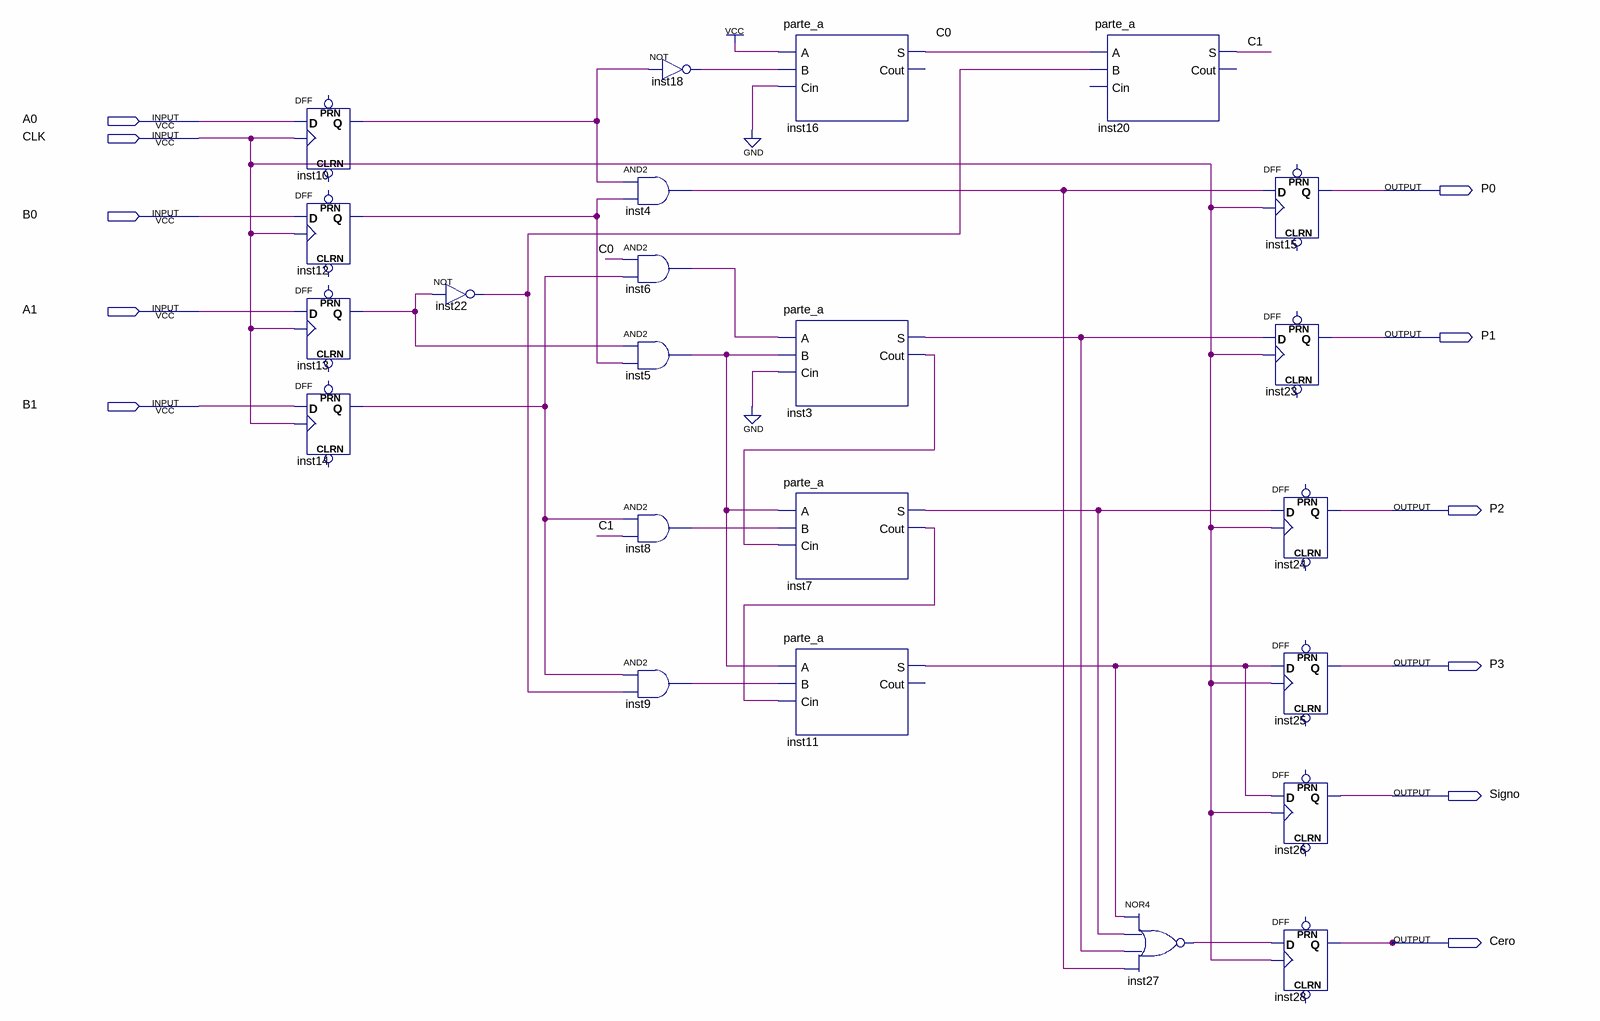
[diagram p0: schematic sheet]
// Quartus schematic parte_c.bdf as structural Verilog: 23 symbols, 11 pins
module parte_c (
  input  A0,
  input  CLK,
  input  B0,
  input  A1,
  input  B1,
  output P0,
  output P1,
  output P2,
  output P3,
  output Signo,
  output Cero
);

  wire C0, C1, inst3_cout, inst3_s, inst4_out, inst5_out, inst6_out, inst7_cout, inst7_s, inst8_out,
       inst9_out, inst10_q, inst11_s, inst12_q, inst13_q, inst14_q, inst18_out, inst22_out, inst27_out;

  DFF inst10 (.CLK(CLK), .D(A0), .Q(inst10_q));  // open: CLRN, PRN
  DFF inst12 (.CLK(CLK), .D(B0), .Q(inst12_q));  // open: CLRN, PRN
  DFF inst13 (.CLK(CLK), .D(A1), .Q(inst13_q));  // open: CLRN, PRN
  DFF inst14 (.CLK(CLK), .D(B1), .Q(inst14_q));  // open: CLRN, PRN
  not inst22 (inst22_out, inst13_q);
  and inst4 (inst4_out, inst10_q, inst12_q);
  and inst6 (inst6_out, C0, inst14_q);
  and inst5 (inst5_out, inst13_q, inst12_q);
  and inst8 (inst8_out, inst14_q, C1);
  and inst9 (inst9_out, inst14_q, inst22_out);
  not inst18 (inst18_out, inst10_q);
  parte_a inst16 (.A(1'b1), .B(inst18_out), .Cin(1'b0), .S(C0));  // open: Cout
  parte_a inst3 (.A(inst6_out), .B(inst5_out), .Cin(1'b0), .S(inst3_s), .Cout(inst3_cout));
  parte_a inst7 (.A(inst5_out), .B(inst8_out), .Cin(inst3_cout), .S(inst7_s), .Cout(inst7_cout));
  parte_a inst11 (.A(inst5_out), .B(inst9_out), .Cin(inst7_cout), .S(inst11_s));  // open: Cout
  parte_a inst20 (.A(C0), .B(inst22_out), .S(C1));  // open: Cin, Cout
  nor inst27 (inst27_out, inst11_s, inst7_s, inst3_s, inst4_out);
  DFF inst15 (.CLK(CLK), .D(inst4_out), .Q(P0));  // open: CLRN, PRN
  DFF inst23 (.CLK(CLK), .D(inst3_s), .Q(P1));  // open: CLRN, PRN
  DFF inst24 (.CLK(CLK), .D(inst7_s), .Q(P2));  // open: CLRN, PRN
  DFF inst25 (.CLK(CLK), .D(inst11_s), .Q(P3));  // open: CLRN, PRN
  DFF inst26 (.CLK(CLK), .D(inst11_s), .Q(Signo));  // open: CLRN, PRN
  DFF inst28 (.CLK(CLK), .D(inst27_out), .Q(Cero));  // open: CLRN, PRN
endmodule
